# EAGLE design Main-v2.0 (EAGLE 9.1.0)
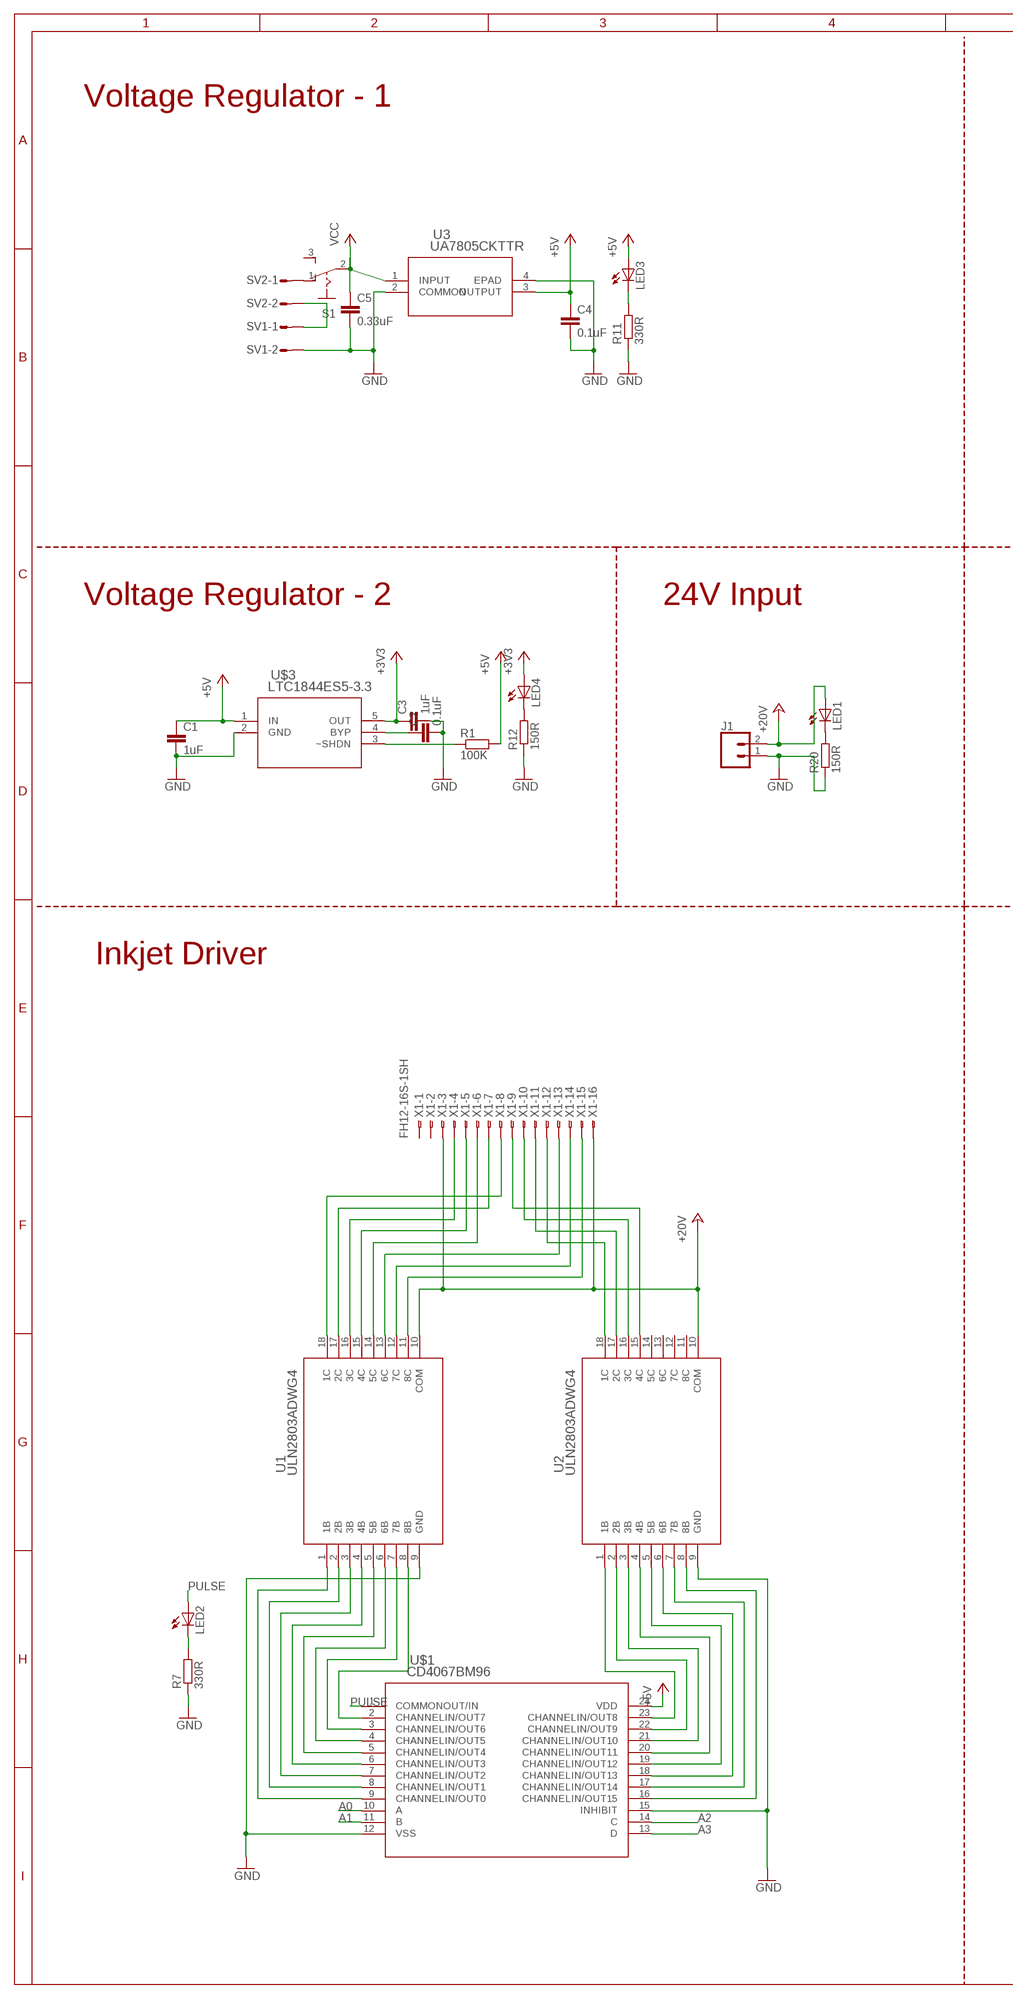
[diagram p0: schematic, sheet 1, part 1 of 2]
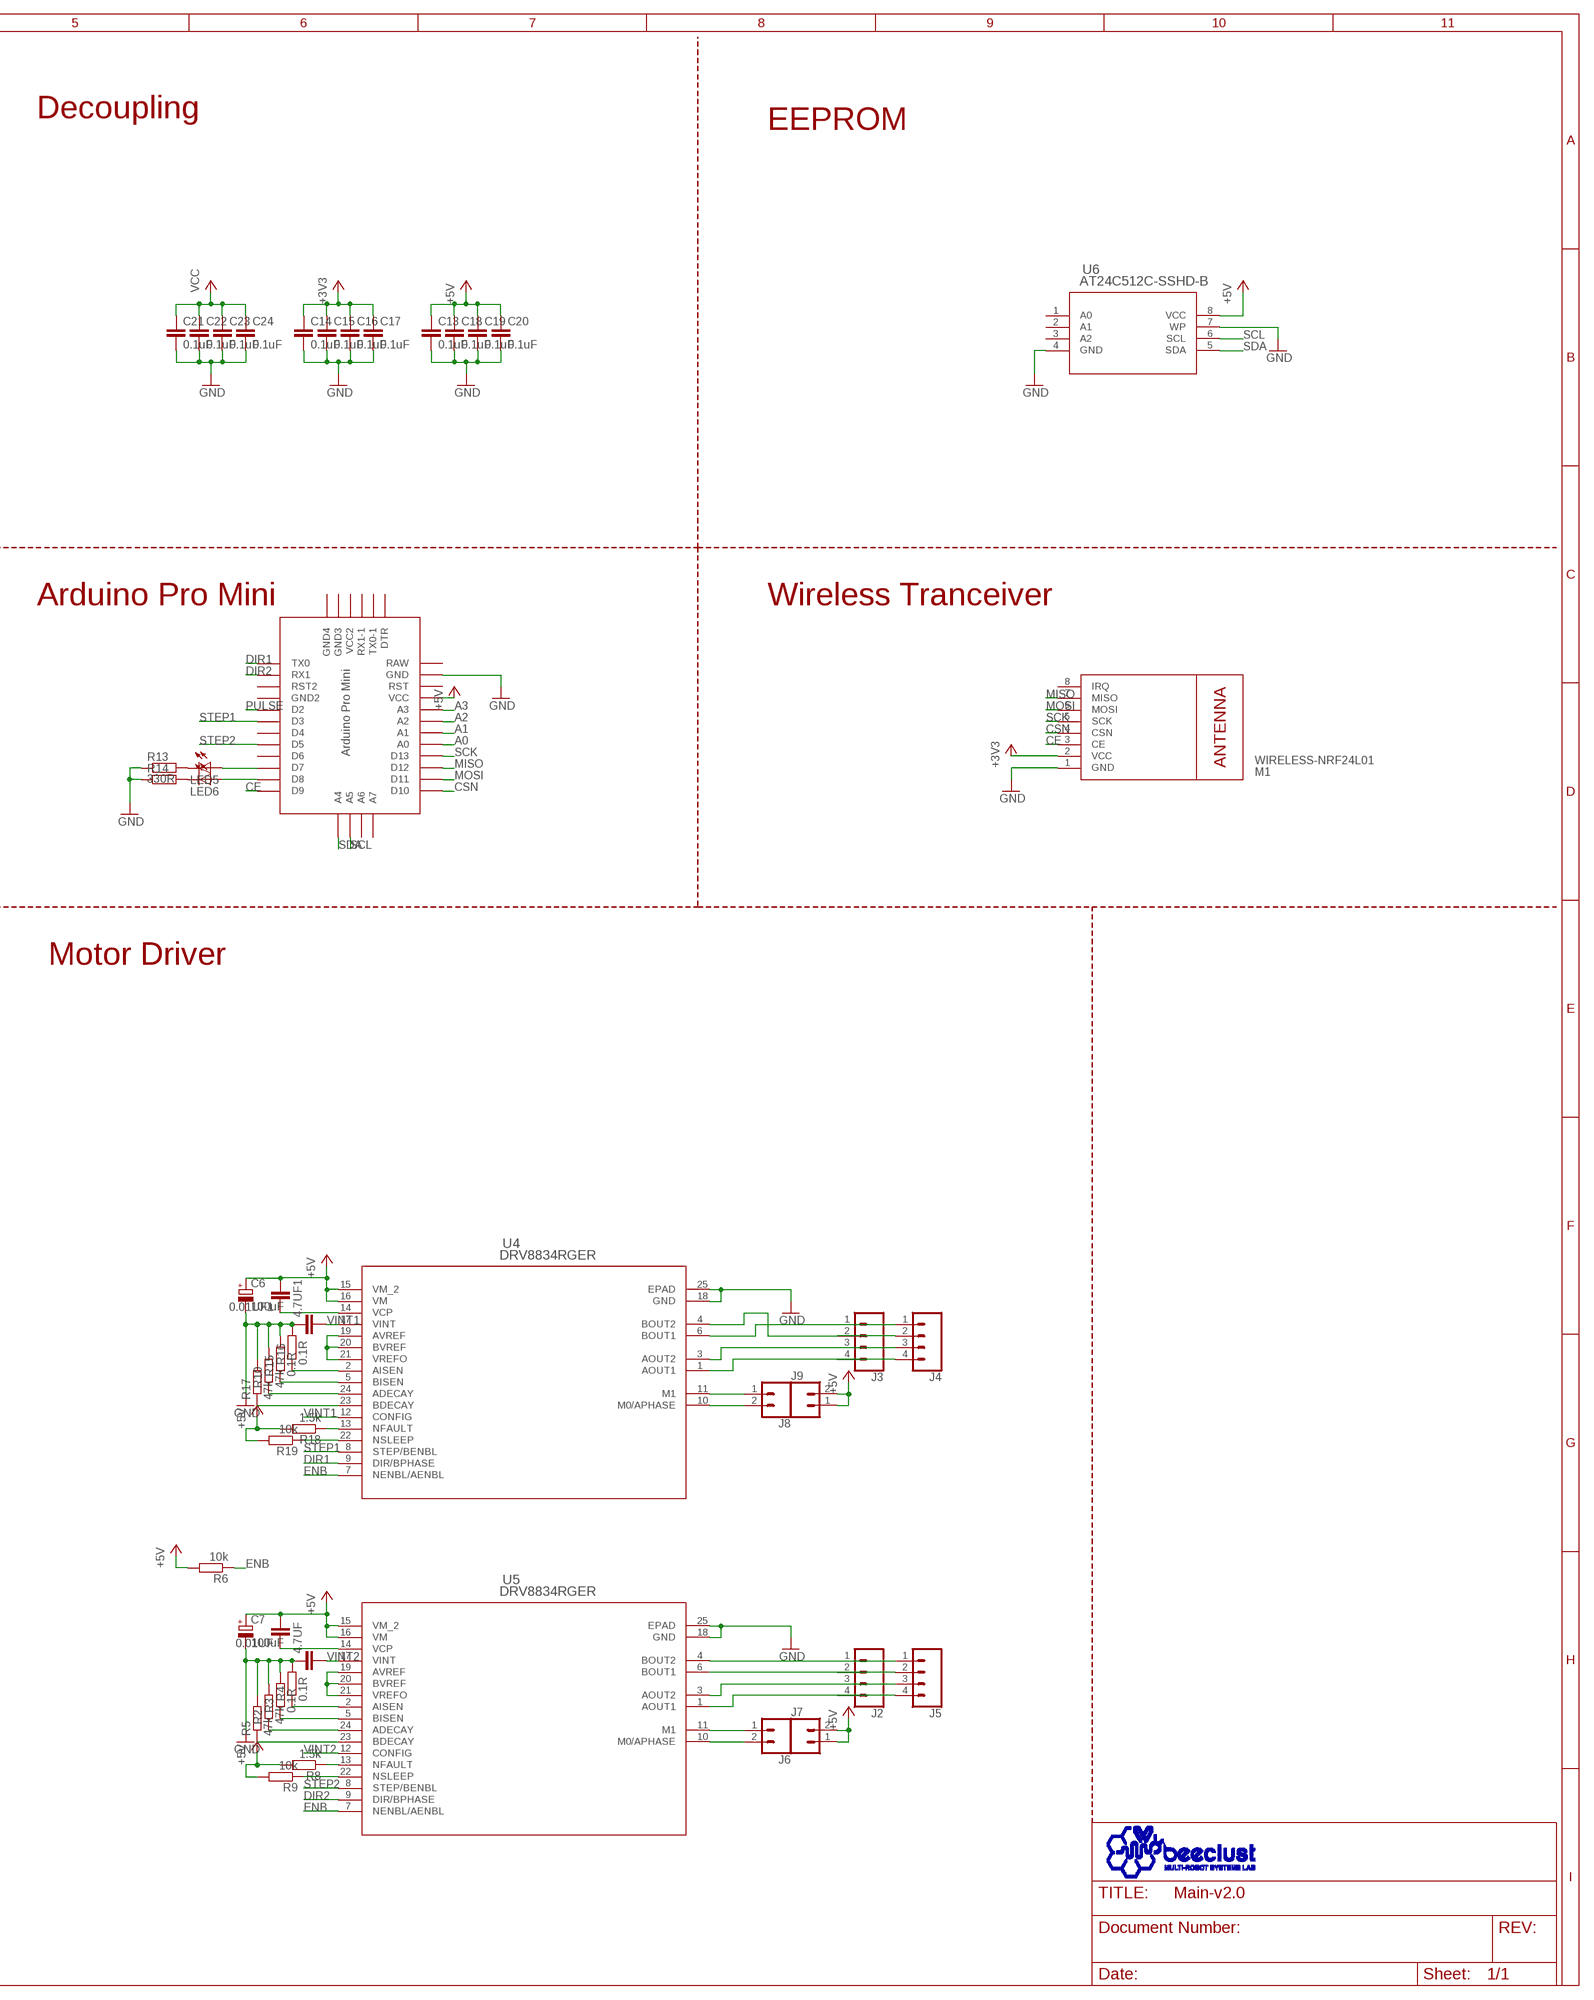
[diagram p1: schematic, sheet 1, part 2 of 2]

## Parts
0.01UF  C-EUC0603K  [C0603K]
0.01UF1  C-EUC0603K  [C0603K]
4.7UF  C-EUC0603K  [C0603K]
4.7UF1  C-EUC0603K  [C0603K]
C1  1uF  C-EUC0603  [C0603]
C2  0.1uF  C-EUC0603  [C0603]
C3  1uF  C-EUC0603  [C0603]
C4  0.1uF  C-EUC0603  [C0603]
C5  0.33uF  C-EUC0603  [C0603]
C6  100uF  CPOL-EUE5-5  [E5-5]
C7  100uF  CPOL-EUE5-5  [E5-5]
C13  0.1uF  C-EUC0603  [C0603]
C14  0.1uF  C-EUC0603  [C0603]
C15  0.1uF  C-EUC0603  [C0603]
C16  0.1uF  C-EUC0603  [C0603]
C17  0.1uF  C-EUC0603  [C0603]
C18  0.1uF  C-EUC0603  [C0603]
C19  0.1uF  C-EUC0603  [C0603]
C20  0.1uF  C-EUC0603  [C0603]
C21  0.1uF  C-EUC0603  [C0603]
C22  0.1uF  C-EUC0603  [C0603]
C23  0.1uF  C-EUC0603  [C0603]
C24  0.1uF  C-EUC0603  [C0603]
J1  CONN_02  [1X02]
J2  CONN_04  [1X04]
J3  CONN_04  [1X04]
J4  CONN_04  [1X04]
J5  CONN_04  [1X04]
J6  CONN_02  [1X02]
J7  CONN_02  [1X02]
J8  CONN_02  [1X02]
J9  CONN_02  [1X02]
LED1  LEDSML0603  [SML0603]
LED2  LEDSML0603  [SML0603]
LED3  LEDSML0603  [SML0603]
LED4  LEDSML0603  [SML0603]
LED5  LEDSML0603  [SML0603]
LED6  LEDSML0603  [SML0603]
M1  WIRELESS-NRF24L01  [WIRELESS-NRF24L01]
R1  100K  R-EU_R0603  [R0603]
R2  47k  R-EU_R0402  [R0402]
R3  0.1R  R-EU_R0402  [R0402]
R4  0.1R  R-EU_R0402  [R0402]
R5  47k  R-EU_R0402  [R0402]
R6  10k  R-EU_R0402  [R0402]
R7  330R  R-EU_R0603  [R0603]
R8  1.5k  R-EU_R0402  [R0402]
R9  10k  R-EU_R0402  [R0402]
R10  47k  R-EU_R0402  [R0402]
R11  330R  R-EU_R0603  [R0603]
R12  150R  R-EU_R0603  [R0603]
R13  330R  R-EU_R0603  [R0603]
R14  R-EU_R0603  [R0603]
R15  0.1R  R-EU_R0402  [R0402]
R16  0.1R  R-EU_R0402  [R0402]
R17  47k  R-EU_R0402  [R0402]
R18  1.5k  R-EU_R0402  [R0402]
R19  10k  R-EU_R0402  [R0402]
R20  150R  R-EU_R0603  [R0603]
S1  255SB  [255SB]
SV1  L02P  [L02P]
SV2  L02P  [L02P]
U1  ULN2803ADWG4  [DW18]
U2  ULN2803ADWG4  [DW18]
U3  UA7805CKTTR  [KTT3_6P22X6P6]
U4  DRV8834RGER  [RGE24_2P45X2P45]
U5  DRV8834RGER  [RGE24_2P45X2P45]
U6  AT24C512C-SSHD-B  [8S1]
U$1  CD4067BM96  [DW24]
U$2  PRO-MINI  [PRO-MINI]
U$3  LTC1844ES5-3.3  [TSOT-23_S5]
U$5  BEECLUST-LOGO  [LOGO]
X1  FH12-16S-1SH  [FH12-16S-1SH]

## Nets
+3V3: C3.1 C14.1 C15.1 C16.1 C17.1 LED4.A M1.2(VCC) U$3.5(OUT)
+5V: 0.01UF1.2 0.01UF.2 C1.1 C4.1 C6.+ C7.+ C13.1 C18.1 C19.1 C20.1 J7.1 J7.2 J9.1 J9.2 LED3.A R1.2 R6.2 R8.2 R9.2 R18.2 R19.2 U3.3(OUTPUT) U4.15(VM_2) U4.16(VM) U5.15(VM_2) U5.16(VM) U6.8(VCC) U$1.24(VDD) U$2.VCC U$3.1(IN)
+24V: J1.2 LED1.A U1.10(COM) U2.10(COM) X1.3 X1.16 ; supply symbol labelled +20V
A0: U$1.10(A) U$2.A0
A1: U$1.11(B) U$2.A1
A2: U$1.14(C) U$2.A2
A3: U$1.13(D) U$2.A3
CE: M1.3(CE) U$2.D9
CSN: M1.4(CSN) U$2.D10
DIR1: U4.9(DIR/BPHASE) U$2.TX0
DIR2: U5.9(DIR/BPHASE) U$2.RX1
ENB: R6.1 U4.7(NENBL/AENBL) U5.7(NENBL/AENBL)
GND: 4.7UF1.1 4.7UF.1 C1.2 C2.2 C3.2 C4.2 C5.2 C6.- C7.- C13.2 C14.2 C15.2 C16.2 C17.2 C18.2 C19.2 C20.2 C21.2 C22.2 C23.2 C24.2 J1.1 M1.1(GND) R2.2 R3.2 R4.2 R5.2 R7.1 R10.2 R11.1 R12.1 R13.1 R14.1 R15.2 R16.2 R17.2 R20.1 SV1.2 U1.9(GND) U2.9(GND) U3.2(COMMON) U3.4(EPAD) U4.18(GND) U4.25(EPAD) U5.18(GND) U5.25(EPAD) U6.4(GND) U6.7(WP) U$1.12(VSS) U$1.15(INHIBIT) U$2.GND U$3.2(GND)
MISO: M1.7(MISO) U$2.D12
MOSI: M1.6(MOSI) U$2.D11
N$1: SV1.1 SV2.2
N$2: U5.19(AVREF) U5.20(BVREF) U5.21(VREFO)
N$3: U1.8(8B) U$1.2(CHANNELIN/OUT7)
N$4: U1.7(7B) U$1.3(CHANNELIN/OUT6)
N$5: U1.6(6B) U$1.4(CHANNELIN/OUT5)
N$6: U1.5(5B) U$1.5(CHANNELIN/OUT4)
N$7: U1.4(4B) U$1.6(CHANNELIN/OUT3)
N$8: U1.3(3B) U$1.7(CHANNELIN/OUT2)
N$9: U1.2(2B) U$1.8(CHANNELIN/OUT1)
N$10: U1.1(1B) U$1.9(CHANNELIN/OUT0)
N$11: U2.1(1B) U$1.23(CHANNELIN/OUT8)
N$12: U2.2(2B) U$1.22(CHANNELIN/OUT9)
N$13: U2.3(3B) U$1.21(CHANNELIN/OUT10)
N$14: U2.4(4B) U$1.20(CHANNELIN/OUT11)
N$15: U2.5(5B) U$1.19(CHANNELIN/OUT12)
N$16: U2.6(6B) U$1.18(CHANNELIN/OUT13)
N$17: J3.1 J4.1 U4.6(BOUT1)
N$18: J3.2 J4.2 U4.4(BOUT2)
N$19: J3.3 J4.3 U4.3(AOUT2)
N$20: J3.4 J4.4 U4.1(AOUT1)
N$21: U1.11(8C) X1.15
N$22: U1.12(7C) X1.14
N$23: U1.13(6C) X1.13
N$24: U1.14(5C) X1.6
N$25: U1.15(4C) X1.5
N$26: U1.16(3C) X1.4
N$27: U1.17(2C) X1.7
N$28: U1.18(1C) X1.8
N$29: U2.8(8B) U$1.16(CHANNELIN/OUT15)
N$30: U2.18(1C) X1.12
N$31: U2.17(2C) X1.11
N$32: U2.16(3C) X1.10
N$33: U2.15(4C) X1.9
N$34: U2.7(7B) U$1.17(CHANNELIN/OUT14)
N$35: J2.1 J5.1 U5.4(BOUT2)
N$36: J2.2 J5.2 U5.6(BOUT1)
N$37: S1.1(O) SV2.1
N$38: C2.1 U$3.4(BYP)
N$39: R1.1 U$3.3(~SHDN)
N$40: J2.3 J5.3 U5.3(AOUT2)
N$41: J2.4 J5.4 U5.1(AOUT1)
N$42: 0.01UF.1 U5.14(VCP)
N$43: R5.1 U5.23(BDECAY)
N$44: R2.1 U5.24(ADECAY)
N$45: LED2.C R7.2
N$46: R3.1 U5.5(BISEN)
N$47: R4.1 U5.2(AISEN)
N$48: R9.1 U5.22(NSLEEP)
N$49: R8.1 U5.13(NFAULT)
N$50: LED3.C R11.2
N$51: LED4.C R12.2
N$52: LED5.C R13.2
N$53: U4.19(AVREF) U4.20(BVREF) U4.21(VREFO)
N$54: R17.1 U4.23(BDECAY)
N$55: LED6.C R14.2
N$56: LED5.A U$2.D7
N$57: LED6.A U$2.D8
N$65: R10.1 U4.24(ADECAY)
N$66: R15.1 U4.5(BISEN)
N$67: R16.1 U4.2(AISEN)
N$68: 0.01UF1.1 U4.14(VCP)
N$73: R19.1 U4.22(NSLEEP)
N$74: R18.1 U4.13(NFAULT)
N$75: J6.2 U5.10(M0/APHASE)
N$76: J6.1 U5.11(M1)
N$77: J8.2 U4.10(M0/APHASE)
N$78: J8.1 U4.11(M1)
N$79: LED1.C R20.2
PULSE: LED2.A U$1.1(COMMONOUT/IN) U$2.D2
SCK: M1.5(SCK) U$2.D13
SCL: U6.6(SCL) U$2.A5
SDA: U6.5(SDA) U$2.A4
STEP1: U4.8(STEP/BENBL) U$2.D3
STEP2: U5.8(STEP/BENBL) U$2.D5
VCC: C5.1 C21.1 C22.1 C23.1 C24.1 S1.2(P) U3.1(INPUT)
VINT1: 4.7UF1.2 U4.12(CONFIG) U4.17(VINT)
VINT2: 4.7UF.2 U5.12(CONFIG) U5.17(VINT)
Unconnected: M1.8(IRQ) S1.3(S) U2.11(8C) U2.12(7C) U2.13(6C) U2.14(5C) U6.1(A0) U6.2(A1) U6.3(A2) U$2.A6 U$2.A7 U$2.D4 U$2.D6 U$2.DTR U$2.GND1(GND2) U$2.GND2(GND4) U$2.GND3 U$2.RST U$2.RST1(RST2) U$2.RX1-1 U$2.TX0-1 U$2.VCC1(VCC2) X1.1 X1.2

## Notes on the sheet
- Voltage Regulator - 1
- Decoupling
- EEPROM
- Voltage Regulator - 2 | 24V Input | Arduino Pro Mini | Wireless Tranceiver
- Inkjet Driver | Motor Driver

## Power pins joined to a net without a drawn wire
RAW: U$2.RAW

## Library data of the parts
0.01UF 0.01UF1 4.7UF 4.7UF1 C1-C5 C13-C24 = resistor:C-EU: CAPACITOR, European symbol
C6 C7 = resistor:CPOL-EU: POLARIZED CAPACITOR, European symbol
J1 J6-J9 = SparkFun-Connectors:CONN_02: Multi connection point. Often used as Generic Header-pin footprint for 0.1 inch spaced/style header connections On any of the 0.1 inch spaced packages, you can populate with these: Break Away Headers - Straight (PRT-00116) Break Away Male Headers - Right Angle (PRT-00553) Female Headers (PRT-00115) Break Away Headers - Machine Pin (PRT-00117) Break Away Female Headers - Swiss Machine Pin (PRT-00743) For SCREWTERMINALS and SPRING TERMINALS visit here: Screw Terimnals on SparkFun.com (5mm/3.5mm/2.54mm spacing) This device is also useful as a general connection point to wire up your design to another part of your project. Our various solder wires solder well into these plated through hole pads. Hook-Up Wire - Assortment (Stranded, 22 AWG) (PRT-11375) Hook-Up Wire - Assortment (Solid Core, 22 AWG) (PRT-11367) View the entire wire category on our website here Special notes: Molex polarized connector foot print use with: PRT-08233 with associated crimp pins and housings. 2.54_SCREWTERM for use with PRT-10571. 3.5mm Screw Terminal footprints for PRT-08084 5mm Screw Terminal footprints for use with PRT-08432
J2-J5 = SparkFun-Connectors:CONN_04: Multi connection point. Often used as Generic Header-pin footprint for 0.1 inch spaced/style header connections On any of the 0.1 inch spaced packages, you can populate with these: Break Away Headers - Straight (PRT-00116) Break Away Male Headers - Right Angle (PRT-00553) Female Headers (PRT-00115) Break Away Headers - Machine Pin (PRT-00117) Break Away Female Headers - Swiss Machine Pin (PRT-00743) For SCREWTERMINALS and SPRING TERMINALS visit here: Screw Terimnals on SparkFun.com (5mm/3.5mm/2.54mm spacing) This device is also useful as a general connection point to wire up your design to another part of your project. Our various solder wires solder well into these plated through hole pads. Hook-Up Wire - Assortment (Stranded, 22 AWG) (PRT-11375) Hook-Up Wire - Assortment (Solid Core, 22 AWG) (PRT-11367) View the entire wire category on our website here Special notes: Molex polarized connector foot print use with SKU : PRT-08231 with associated crimp pins and housings. 1MM SMD Version SKU: PRT-10208; PROD_ID: CONN-09696
LED1-LED6 = led:LED: LED OSRAM: - CHIPLED LG R971, LG N971, LY N971, LG Q971, LY Q971, LO R971, LY R971 LH N974, LH R974 LS Q976, LO Q976, LY Q976 LO Q996 - Hyper CHIPLED LW Q18S LB Q993, LB Q99A, LB R99A - SideLED LS A670, LO A670, LY A670, LG A670, LP A670 LB A673, LV A673, LT A673, LW A673 LH A674 LY A675 LS A676, LA A676, LO A676, LY A676, LW A676 LS A679, LY A679, LG A679 - Hyper Micro SIDELED® LS Y876, LA Y876, LO Y876, LY Y876 LT Y87S - SmartLED LW L88C, LW L88S LB L89C, LB L89S, LG L890 LS L89K, LO L89K, LY L89K LS L896, LA L896, LO L896, LY L896 - TOPLED LS T670, LO T670, LY T670, LG T670, LP T670 LSG T670, LSP T670, LSY T670, LOP T670, LYG T670 LG T671, LOG T671, LSG T671 LB T673, LV T673, LT T673, LW T673 LH T674 LS T676, LA T676, LO T676, LY T676, LB T676, LH T676, LSB T676, LW T676 LB T67C, LV T67C, LT T67C, LS T67K, LO T67K, LY T67K, LW E67C LS E67B, LA E67B, LO E67B, LY E67B, LB E67C, LV E67C, LT E67C LW T67C LS T679, LY T679, LG T679 LS T770, LO T770, LY T770, LG T770, LP T770 LB T773, LV T773, LT T773, LW T773 LH T774 LS E675, LA E675, LY E675, LS T675 LS T776, LA T776, LO T776, LY T776, LB T776 LHGB T686 LT T68C, LB T68C - Hyper Mini TOPLED® LB M676 - Mini TOPLED Santana® LG M470 LS M47K, LO M47K, LY M47K Source: http://www.osram.convergy.de LUXEON: - LUMILED® LXK2-PW12-R00, LXK2-PW12-S00, LXK2-PW14-U00, LXK2-PW14-V00 LXK2-PM12-R00, LXK2-PM12-S00, LXK2-PM14-U00 LXK2-PE12-Q00, LXK2-PE12-R00, LXK2-PE12-S00, LXK2-PE14-T00, LXK2-PE14-U00 LXK2-PB12-K00, LXK2-PB12-L00, LXK2-PB12-M00, LXK2-PB14-N00, LXK2-PB14-P00, LXK2-PB14-Q00 LXK2-PR12-L00, LXK2-PR12-M00, LXK2-PR14-Q00, LXK2-PR14-R00 LXK2-PD12-Q00, LXK2-PD12-R00, LXK2-PD12-S00 LXK2-PH12-R00, LXK2-PH12-S00 LXK2-PL12-P00, LXK2-PL12-Q00, LXK2-PL12-R00 Source: www.luxeon.com KINGBRIGHT: KA-3528ASYC Source: www.kingbright.com
M1 = diy-modules:WIRELESS-NRF24L01: 2.4 GHz Wireless Module based on NRF24L01 chip More details available here: http://www.electrodragon.com/w/NRF24L01 Click here to find device on ebay.com
R1-R20 = resistor:R-EU_: RESISTOR, European symbol
S1 = switch:255SB: SLIDING SWITCH Distributor Buerklin, 11G810
SV1 SV2 = con-amp-mt:L02P: AMP MT CONNECTOR; OC_FARNELL: unknown; OC_NEWARK: unknown
U1 U2 = Beeclust:ULN2803ADWG4; MANUFACTURER_PART_NUMBER: ULN2803ADWG4; VENDOR: Texas Instruments
U3 = Beeclust:UA7805CKTTR; MANUFACTURER_PART_NUMBER: UA7805CKTTR; VENDOR: Texas Instruments
U4 U5 = Beeclust:DRV8834RGER; MANUFACTURER_PART_NUMBER: DRV8834RGER; VENDOR: Texas Instruments
U6 = Beeclust:AT24C512C-SSHD-B; MANUFACTURER_PART_NUMBER: AT24C512CSSHDB; VENDOR: ATMEL
U$1 = Beeclust:CD4067BM96; MANUFACTURER_PART_NUMBER: CD4067B_DW_24; VENDOR: Texas Instruments
U$2 = Arduino-clone:PRO-MINI: Arduion Pro Mini Clone V1.0 www.betemcu.cu
U$3 = Beeclust:LTC1844ES5-3.3
U$5 = Beeclust:BEECLUST-LOGO
X1 = con-hirose:FH12-16S-1S: 1mm Pitch Connectors For FPC/FFC Source: Data sheet; OC_FARNELL: unknown; OC_NEWARK: unknown

## Board
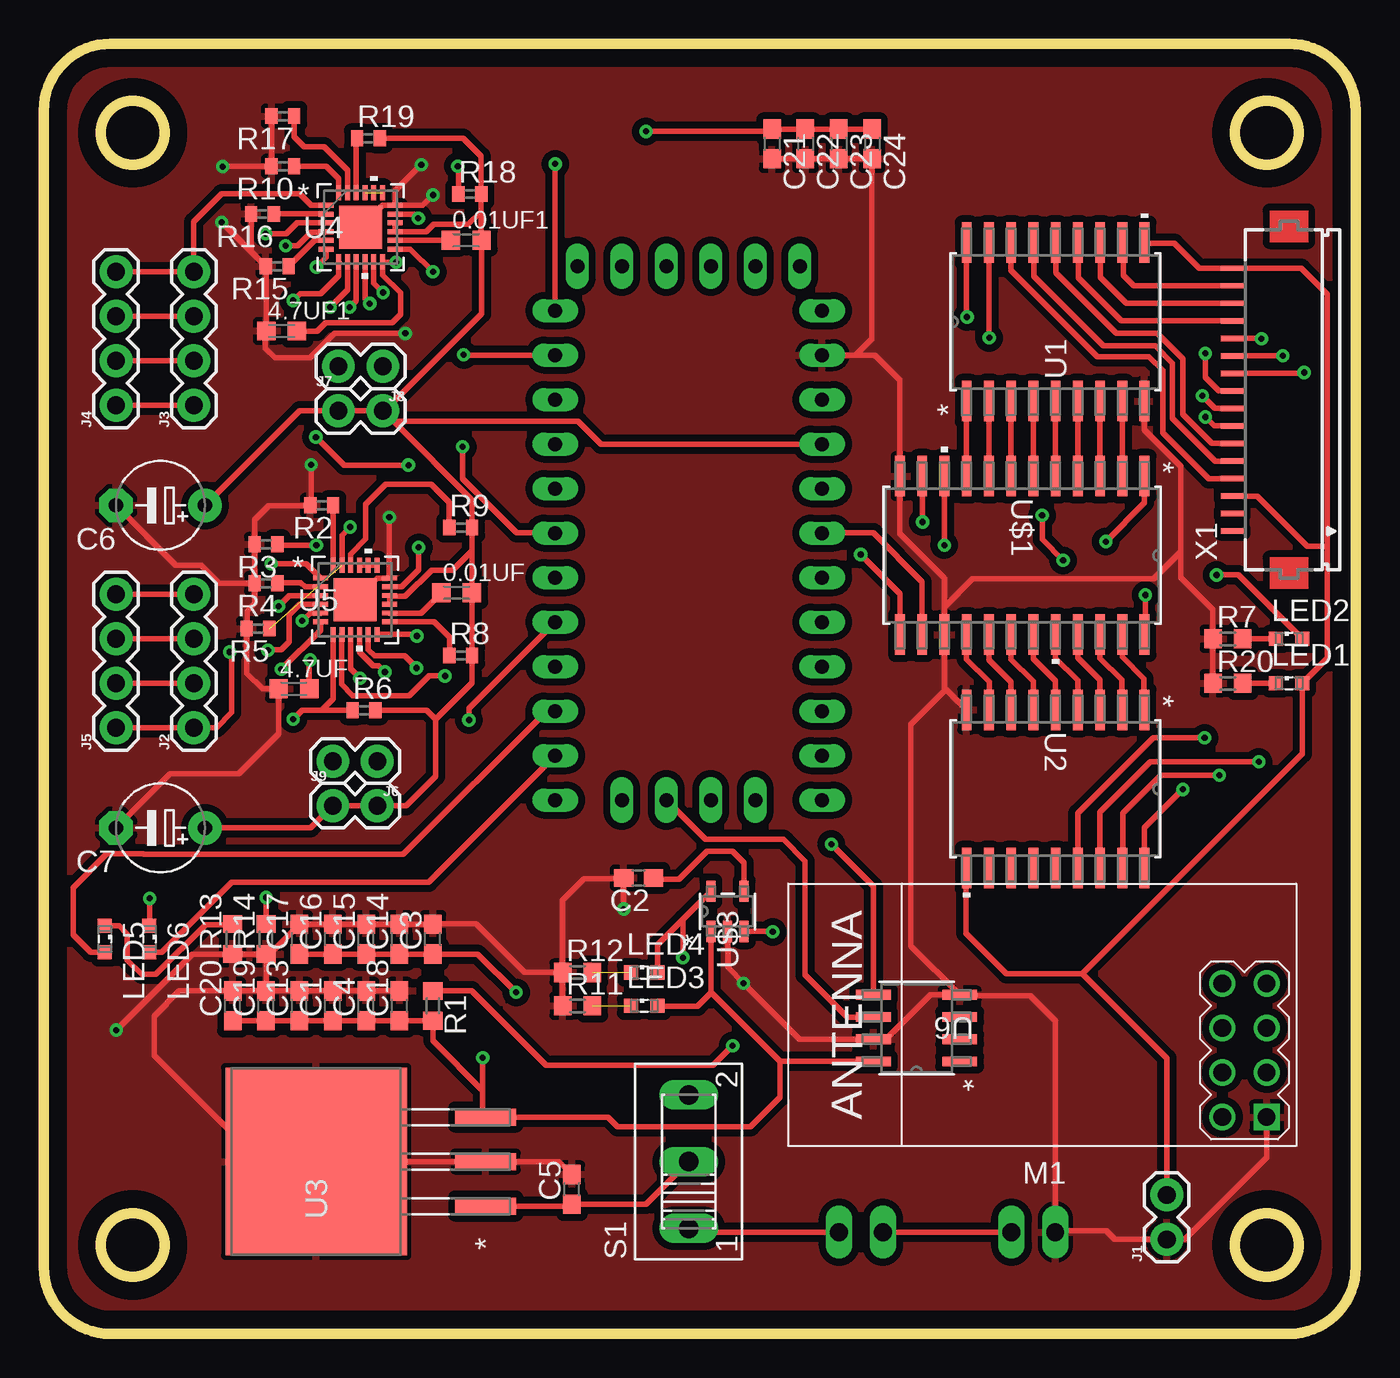
[diagram p2: board, top side]
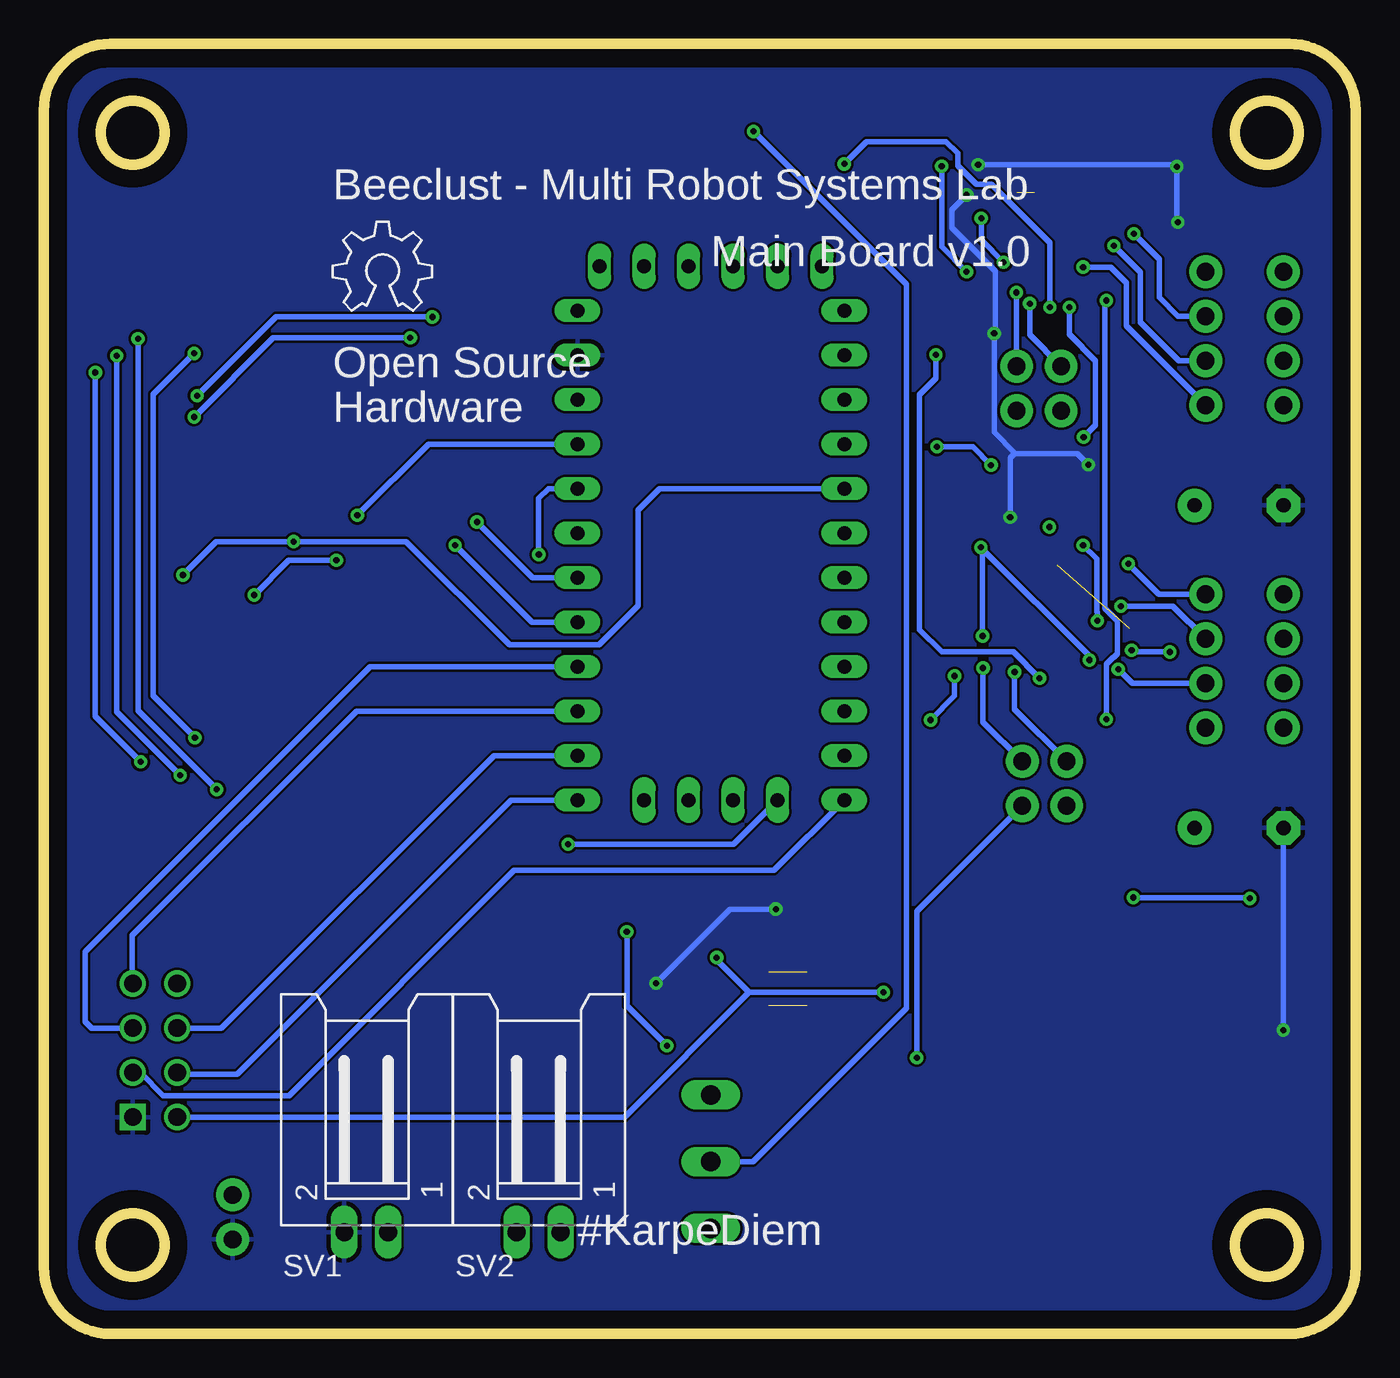
[diagram p3: board, bottom side, seen from below]

Size 74.93 x 73.66 mm. Coordinates in mm from the lower left corner, seen from the top.
Outline: 0,3.81 arc90 3.81,0 71.12,0 arc90 74.93,3.81 74.93,69.85 arc90 71.12,73.66 3.81,73.66 arc90 0,69.85 0,3.81
Outline: circle at 69.85,68.58 radius 1.8
Outline: circle at 5.08,68.58 radius 1.8
Outline: circle at 5.08,5.08 radius 1.8
Outline: circle at 69.85,5.08 radius 1.8
Copper layers (1*16): Top 0.035mm / dielectric 1.5mm / Bottom 0.035mm
Design rules "default": minimum track width 6mil, minimum drill 0.35mm, track to track 6mil, track to pad 6mil, pad to pad 6mil, via to via 6mil, smd to smd 6mil, copper to edge 40mil, drill to drill 6mil, minimum pad ring 10mil, minimum via ring 8mil, stop-mask expansion 4mil, vias tented up to drill 0mil, thermal gap 10mil

### Footprints (pad centres in the part's own frame; a part is rotated, then mirrored left to right if it is on the bottom)
C0603K = smd 1.05 x 1.08: 1 -0.875,0; 2 0.875,0
C0603 = smd 1.1 x 1: 1 -0.85,0; 2 0.85,0
E5-5 = drill 0.813 pad 1.905: + -2.54,0 | drill 0.813 pad 1.905 octagon: - 2.54,0
1X02 = drill 1.016 pad 1.88: 1 0,0; 2 2.54,0
1X04 = drill 1.016 pad 1.88: 1 0,0; 2 2.54,0; 3 5.08,0; 4 7.62,0
SML0603 = smd 0.8 x 0.8: A 0.75,0; C -0.75,0
WIRELESS-NRF24L01 = drill 1 square: 1 -12.7,6.35 | drill 1: 2 -10.16,6.35; 3 -12.7,3.81; 4 -10.16,3.81; 5 -12.7,1.27; 6 -10.16,1.27; 7 -12.7,-1.27; 8 -10.16,-1.27
R0603 = smd 1 x 1.1: 1 -0.85,0; 2 0.85,0
R0402 = smd 0.7 x 0.9: 1 -0.65,0; 2 0.65,0
255SB = drill 1.118 long: 1 -3.81,0; 2 0,0; 3 3.81,0
L02P = drill 1.016 long: 1 1.25,-6.25; 2 -1.25,-6.25
DW18 = smd 2.311 x 0.559: 1 -4.521,5.08; 2 -4.521,3.81; 3 -4.521,2.54; 4 -4.521,1.27; 5 -4.521,0; 6 -4.521,-1.27; 7 -4.521,-2.54; 8 -4.521,-3.81; 9 -4.521,-5.08; 10 4.521,-5.08; 11 4.521,-3.81; 12 4.521,-2.54; 13 4.521,-1.27; 14 4.521,0; 15 4.521,1.27; 16 4.521,2.54; 17 4.521,3.81; 18 4.521,5.08
KTT3_6P22X6P6 = smd 0.965 x 3.505: 1 -2.54,-9.677; 2 0,-9.677; 3 2.54,-9.677 | smd 10.719 x 10.363: 4 0,0
RGE24_2P45X2P45 = smd 0.85 x 0.28: 1 -1.975,1.25; 2 -1.975,0.75; 3 -1.975,0.25; 4 -1.975,-0.25; 5 -1.975,-0.75; 6 -1.975,-1.25; 13 1.975,-1.25; 14 1.975,-0.75; 15 1.975,-0.25; 16 1.975,0.25; 17 1.975,0.75; 18 1.975,1.25 | smd 0.28 x 0.85: 7 -1.25,-1.975; 8 -0.75,-1.975; 9 -0.25,-1.975; 10 0.25,-1.975; 11 0.75,-1.975; 12 1.25,-1.975; 19 1.25,1.975; 20 0.75,1.975; 21 0.25,1.975; 22 -0.25,1.975; 23 -0.75,1.975; 24 -1.25,1.975 | smd 2.45 x 2.45: 25 0,0
8S1 = smd 1.981 x 0.561: 1 -2.465,1.905; 2 -2.465,0.635; 3 -2.465,-0.635; 4 -2.465,-1.905; 5 2.465,-1.905; 6 2.465,-0.635; 7 2.465,0.635; 8 2.465,1.905
DW24 = smd 2.311 x 0.559: 1 -4.521,6.985; 2 -4.521,5.715; 3 -4.521,4.445; 4 -4.521,3.175; 5 -4.521,1.905; 6 -4.521,0.635; 7 -4.521,-0.635; 8 -4.521,-1.905; 9 -4.521,-3.175; 10 -4.521,-4.445; 11 -4.521,-5.715; 12 -4.521,-6.985; 13 4.521,-6.985; 14 4.521,-5.715; 15 4.521,-4.445; 16 4.521,-3.175; 17 4.521,-1.905; 18 4.521,-0.635; 19 4.521,0.635; 20 4.521,1.905; 21 4.521,3.175; 22 4.521,4.445; 23 4.521,5.715; 24 4.521,6.985
PRO-MINI = drill 0.8 long: A0 8.89,8.89; A1 8.89,11.43; A2 8.89,13.97; A3 8.89,16.51; A4 -2.54,-1.27; A5 0,-1.27; A6 2.54,-1.27; A7 5.08,-1.27; D2 -6.35,16.51; D3 -6.35,13.97; D4 -6.35,11.43; D5 -6.35,8.89; D6 -6.35,6.35; D7 -6.35,3.81; D8 -6.35,1.27; D9 -6.35,-1.27; D10 8.89,-1.27; D11 8.89,1.27; D12 8.89,3.81; D13 8.89,6.35; DTR 7.62,29.21; GND 8.89,24.13; GND1 -6.35,19.05; GND2 -5.08,29.21; GND3 -2.54,29.21; RAW 8.89,26.67; RST 8.89,21.59; RST1 -6.35,21.59; RX1 -6.35,24.13; RX1-1 2.54,29.21; TX0 -6.35,26.67; TX0-1 5.08,29.21; VCC 8.89,19.05; VCC1 0,29.21
TSOT-23_S5 = smd 1.219 x 0.508: 1 -1.143,0.95; 2 -1.143,0; 3 -1.143,-0.95; 4 1.143,-0.95; 5 1.143,0.95
FH12-16S-1SH = smd 0.3 x 1.3: 1 -7.5,3.25; 2 -6.5,3.25; 3 -5.5,3.25; 4 -4.5,3.25; 5 -3.5,3.25; 6 -2.5,3.25; 7 -1.5,3.25; 8 -0.5,3.25; 9 0.5,3.25; 10 1.5,3.25; 11 2.5,3.25; 12 3.5,3.25; 13 4.5,3.25; 14 5.5,3.25; 15 6.5,3.25; 16 7.5,3.25

### Placement (x,y rotation side)
0.01UF  23.58,42.32 0 top
0.01UF1  24.13,62.45 0 top
4.7UF  14.29,36.83 0 top
4.7UF1  13.59,57.26 0 top
C1  16.51,18.73 90 top
C2  33.97,26.04 180 top
C3  22.23,22.54 90 top
C4  18.41,18.73 90 top
C5  30.16,8.26 90 top
C6  6.67,47.31 180 top
C7  6.67,28.89 180 top
C13  14.61,18.73 90 top
C14  20.32,22.54 90 top
C15  18.41,22.54 90 top
C16  16.51,22.54 90 top
C17  14.61,22.54 90 top
C18  20.32,18.73 90 top
C19  12.7,18.73 90 top
C20  10.79,18.73 90 top
C21  41.59,67.95 270 top
C22  43.5,67.95 270 top
C23  45.4,67.95 270 top
C24  47.31,67.95 270 top
J1  64.14,5.4 90 top
J2  8.57,34.61 90 top
J3  8.57,53.02 90 top
J4  4.13,53.02 90 top
J5  4.13,34.61 90 top
J6  19.05,32.7 180 top
J7  16.83,52.7 0 top
J8  19.37,55.24 180 top
J9  16.51,30.16 0 top
LED1  71.12,37.15 0 top
LED2  71.12,39.69 0 top
LED3  34.29,18.73 0 top
LED4  34.29,20.64 0 top
LED5  3.49,22.54 270 top
LED6  6.03,22.54 270 top
M1  57.15,18.73 180 top
R1  22.23,18.73 270 top
R2  15.88,47.31 180 top
R3  12.7,45.08 180 top
R4  12.7,42.86 180 top
R5  12.24,40.27 180 top
R6  18.29,35.61 0 top
R7  67.63,39.69 0 top
R8  23.81,38.73 0 top
R9  23.81,46.04 0 top
R10  13.65,66.67 180 top
R11  30.48,18.73 0 top
R12  30.48,20.64 0 top
R13  10.79,22.54 90 top
R14  12.7,22.54 90 top
R15  13.34,60.96 180 top
R16  12.5,63.94 180 top
R17  13.65,69.53 180 top
R18  24.33,65.09 0 top
R19  18.54,68.26 0 top
R20  67.63,37.15 0 top
S1  36.83,9.84 90 top
SV1  56.52,12.07 0 bottom
SV2  46.67,12.07 0 bottom
U1  57.78,57.78 90 top
U2  57.78,31.11 270 top
U3  15.56,9.84 90 top
U4  18.1,63.18 0 top
U5  17.78,41.91 0 top
U6  49.85,17.46 180 top
U$1  55.88,44.45 270 top
U$2  35.56,31.75 0 top
U$3  39.05,24.13 90 top
U$4  [OSHW_6X200_NOTEXT]  58.42,58.42 0 bottom
U$5  -4.88,-14.05 0 top  (outside the outline)
X1  71.12,53.34 90 top

### Tracks (layer width: path | path; a pad name or v marks a point on that pad's centre or on a via)
+3V3  (via drill 0.35)
  Top 0.305: LED4.A 35.04,22.21 36.5,23.67 | U$3.5 36.53,23.7 36.5,23.67 | C17.1 C16.1 C15.1 C14.1 C3.1 24.79,21.69 v26.98,19.51 | v36.5,21.49 36.5,23.67
  Bottom 0.305: v36.5,21.49 36.56,21.43 34.65,19.51 | 34.65,19.51 v26.98,19.51 | 34.65,19.51 41.77,12.38 M1.2
+5V  (via drill 0.35)
  Top 0.305: 24.98,64.08 24.98,62.47 0.01UF1.2 25,58.25 19.41,52.66 | 24.98,64.08 R18.2 24.97,65.1 24.97,67.23 23.94,68.26 R19.2 | U4.16 U4.15 21.84,62.93 22.25,63.35 24.25,63.35 24.98,64.08 | C7.+ 15.24,28.89 J9.1 J9.2 20.69,30.16 22.38,31.85 22.38,35.1 | 38.1,19.51 U$3.1 | 38.1,19.51 38.1,19.48 37.34,18.72 35.05,18.72 LED3.A | U6.8 42.05,15.56 | 42.05,15.56 38.1,19.51 | 25.07,13.89 22.23,16.74 R1.2 C18.1 C4.1 C1.1 C13.1 C19.1 C20.1 | 25.07,13.89 25.07,12.55 U3.3 32.22,12.38 32.77,11.84 40.36,11.84 42.05,13.53 42.05,15.56 | C6.+ 14.61,52.7 J7.1 J7.2 19.41,52.66 | 20,52.08 19.41,52.66 | 20,52.08 24.46,47.61 R9.2 24.46,44.73 | 24.46,42.34 24.46,44.73 | 24.46,42.34 0.01UF.2 | 24.46,44.73 23.34,43.61 22.15,43.61 20.65,42.11 19.8,42.11 U5.16 U5.15 | 24.46,42.34 R8.2 24.46,37.19 22.38,35.1 | v57.02,46.74 57.02,45.36 v58.22,44.17 | v62.92,42.19 62.92,39.98 U$1.24 | 25.07,13.89 v25.07,15.77 | U$2.VCC 31.83,50.8 30.5,52.12 20.04,52.12 20,52.08 | 22.38,35.1 21.87,35.61 R6.2
  Bottom 0.305: U$2.VCC 52.96,50.8 v57.02,46.74 | v58.22,44.17 60.94,44.17 v62.92,42.19 | v25.07,15.77 25.07,24.14 J9.2
+24V
  Top 0.305: U2.10 52.68,26.57 52.68,22.89 54.99,20.57 59.31,20.57 | 59.31,20.57 64.14,15.75 J1.2 | 59.31,20.57 71.87,33.13 LED1.A 73.3,38.58 73.3,44.98 | U1.10 62.89,62.28 64.57,62.28 66.01,60.84 X1.16 71.82,60.84 73.3,59.36 73.3,44.98 | 73.3,44.98 72.16,44.98 69.32,47.83 67.88,47.83 X1.3
A0  (via drill 0.35)
  Top 0.305: v51.44,45.03 U$1.10
  Bottom 0.305: U$2.A0 47.04,40.64 v51.44,45.03
A1  (via drill 0.35)
  Top 0.305: v50.19,46.35 50.19,48.95 U$1.11
  Bottom 0.305: U$2.A1 47.02,43.18 v50.19,46.35
A2
  Top 0.305: U$1.14 50.16,42.95 47.37,45.74 44.48,45.74 U$2.A2
A3  (via drill 0.35)
  Top 0.305: U$1.13 48.9,42.27 v46.66,44.5
  Bottom 0.305: v46.66,44.5 46.66,47.7 46.1,48.26 U$2.A3
CE
  Bottom 0.305: M1.3 69.41,14.92 68.1,13.61 60.91,13.61 48.06,26.47 33.22,26.47 U$2.D9
CSN
  Bottom 0.305: U$2.D10 48.23,30.48 63.88,14.83 67.22,14.83 M1.4
DIR1  (via drill 0.35)
  Top 0.305: U4.9 17.85,58.99 v17.48,58.62 | v29.21,66.8 U$2.TX0
  Bottom 0.305: v17.48,58.62 17.48,62.31 20.8,65.63 21.67,65.63 22.73,66.7 22.73,67.41 23.39,68.07 27.94,68.07 v29.21,66.8
DIR2  (via drill 0.35)
  Top 0.305: U5.9 17.53,37.97 v18.06,37.44 | v23.98,55.9 24,55.88 U$2.RX1
  Bottom 0.305: 18.06,37.54 v18.06,37.44 19.56,38.94 23.65,38.94 24.92,40.21 24.92,53.62 23.98,54.56 v23.98,55.9
ENB  (via drill 0.35)
  Top 0.305: U5.7 16.53,36.26 15.88,35.61 | 16.87,61.19 U4.7 16.85,60.41 15.82,59.38 14.63,59.38 v14.25,59 | 15.88,35.61 R6.1 | 15.88,35.61 14.76,35.61 v14.25,35.1
  Bottom 0.305: v14.25,35.1 14.25,38.23 13.85,38.63 13.82,38.63 13.61,38.84 13.61,40.72 14.33,41.43 14.33,58.93 v14.25,59
GND  (via drill 0.35)
  Top 0.305: M1.1 69.85,10.08 65.16,5.4 J1.1 61.18,5.4 60.68,5.89 57.84,5.89 SV1.2 57.77,17.88 56.34,19.3 52.38,19.3 U6.4 | R11.1 R12.1 | C5.2 29.43,9.84 U3.2 U3.4 12.38,9.84 6.3,15.93 6.3,18.14 7.75,19.58 C20.2 C19.2 | U6.4 50.65,19.38 48.09,16.83 U6.7 43.17,16.83 v39.97,20.03 39.06,20.93 39.06,22.97 U$3.2 | R12.1 27.47,20.64 24.69,23.42 22.25,23.42 C3.2 C14.2 C15.2 C16.2 C17.2 12.9,21.69 R14.1 | C7.- 7.21,31.98 11.12,31.98 13.41,34.27 4.7UF.1 | 4.7UF.1 13.35,36.89 | U5.25 19.02,43.15 19.3,43.15 19.3,43.16 U5.18 19.74,43.18 v19.74,46.63 | U6.4 49.53,22.15 49.53,34.82 51.44,36.73 51.44,36.78 | 51.44,36.78 U$1.15 51.44,41.5 | U2.9 51.56,36.78 51.44,36.78 | 51.44,41.5 51.44,43.15 48.9,45.7 U$1.12 48.9,54.46 47.47,55.88 46.35,55.88 | 46.35,55.88 U$2.GND | U1.9 62.87,51.61 64.95,49.53 64.95,44.65 | 64.95,44.65 64.95,43.18 66.78,41.35 R7.1 | 66.57,39.89 R7.1 | R14.1 R13.1 8.48,21.69 v4.14,17.35 | C19.2 R14.1 | C19.2 C13.2 C1.2 C4.2 C18.2 | C21.2 C22.2 C23.2 C24.2 47.31,56.83 46.35,55.88 | R7.1 R20.1 | 51.44,41.5 53.03,43.1 63.4,43.1 64.95,44.65 | 12.7,60.95 R15.2 | R17.2 R10.2 10.24,66.67 v10.21,66.65 | R12.1 29.63,24.75 30.86,25.98 33.07,25.98 C2.2 v33.12,24.26 | R4.2 R3.2 12.05,46.49 12.85,47.29 15.21,47.29 R2.2 15.27,47.35 v15.27,49.63 | 4.7UF.1 12.5,36.83 11.59,37.73 R5.2 11.61,40.29 11.61,41.27 12.05,41.72 R4.2 | R15.2 11.85,61.8 | 11.85,61.8 R16.2 | 11.85,61.8 v10.17,63.48 v10.16,63.48 | U4.18 20.07,65.26 v21.57,66.75 | R4.2 10.02,42.86 8.99,43.89 7.54,43.89 C6.- | R15.2 12.71,60.93 4.7UF1.1 12.65,57.2 12.65,56.29 13.21,55.73 15.21,55.73 16.61,57.12 v20.65,57.12 | U4.18 21.63,64.43 v22.23,65.02
  Top 0.305: U4.18 19.62,64.43 19.61,64.43 19.34,64.43 U4.25
  Bottom 0.305: v4.14,17.35 C7.- | v33.12,24.26 35.74,24.26 v39.97,20.03 | v10.16,63.48 10.21,63.52 v10.21,66.65 10.31,66.75 v21.57,66.75 | 19.46,50.29 20.65,51.49 v20.65,57.12 20.57,57.2 20.57,60.68 23.06,63.17 23.06,64.19 v22.23,65.02 | 19.46,50.29 19.43,50.27 15.9,50.27 v15.27,49.63 | v19.74,46.63 19.74,50.01 19.46,50.29
  pour Top (isolate 0.406): 0.64,73.03 74.3,73.03 74.3,59.05 74.3,1.27 0.64,1.27
  pour Bottom: 1.27,73.03 74.04,73.03 arc-90 74.3,72.14 74.3,1.27 0.89,1.27 arc-90 0.64,1.52 0.64,72.39
MISO
  Bottom 0.305: U$2.D12 57.07,35.56 69.88,22.76 69.88,20.03 M1.7
MOSI
  Bottom 0.305: U$2.D11 49.23,33.02 64.8,17.45 67.3,17.45 M1.6
N$1
  Top 0.305: SV1.1 SV2.2
N$2
  Top 0.305: U5.19 U5.20 U5.21
N$3
  Top 0.305: U1.8 U$1.2
N$4
  Top 0.305: U1.7 U$1.3
N$5
  Top 0.305: U1.6 U$1.4
N$6
  Top 0.305: U1.5 U$1.5
N$7
  Top 0.305: U1.4 U$1.6
N$8
  Top 0.305: U1.3 U$1.7
N$9
  Top 0.305: U1.2 U$1.8
N$10
  Top 0.305: U1.1 U$1.9
N$11
  Top 0.305: U$1.23 61.59,38.66 62.84,37.41 62.84,35.66 U2.1
N$12
  Top 0.305: U$1.22 60.33,38.58 61.57,37.34 61.57,35.66 U2.2
N$13
  Top 0.305: U$1.21 59.05,38.61 60.33,37.34 U2.3
N$14
  Top 0.305: U$1.20 57.78,38.58 59.05,37.31 U2.4
N$15
  Top 0.305: U$1.19 56.52,38.56 57.78,37.29 U2.5
N$16
  Top 0.305: U$1.18 55.24,38.53 56.52,37.26 U2.6
N$17  (via drill 0.35)
  Top 0.305: J4.1 J3.1 | v15.57,60.91 16.12,61.46 U4.6
  Bottom 0.305: J3.1 13.11,57.56 13.11,60.02 13.99,60.91 v15.57,60.91
N$18  (via drill 0.35)
  Top 0.305: J4.2 J3.2 | U4.4 16.08,62.89 15.27,62.89 14.51,62.13 v13.82,62.13
  Bottom 0.305: v13.82,62.13 12.29,60.6 12.29,57.76 10.1,55.56 J3.2
N$19  (via drill 0.35)
  Top 0.305: J3.3 J4.3 | U4.3 16.11,63.45 14.48,63.45 13.84,62.81 v12.68,62.81
  Bottom 0.305: v12.68,62.81 11.23,61.37 11.23,59.18 10.15,58.1 J3.3
N$20
  Top 0.305: J4.4 J3.4 8.57,63.5 10.16,65.09 14.61,65.09 15.26,64.43 U4.1
N$21
  Top 0.305: X1.15 62.26,59.84 61.65,60.45 61.65,62.25 U1.11
N$22
  Top 0.305: X1.14 61.84,58.84 60.35,60.32 60.35,62.28 U1.12
N$23
  Top 0.305: X1.13 61.54,57.84 59.08,60.3 59.08,62.28 U1.13
N$24
  Top 0.305: X1.6 66.71,50.84 65.05,52.5 65.05,55.68 63.6,57.12 61.27,57.12 57.81,60.58 57.81,62.28 U1.14
N$25
  Top 0.305: X1.5 66.9,49.84 64.47,52.27 64.47,55.42 63.48,56.41 60.53,56.41 56.54,60.4 56.54,62.28 U1.15
N$26
  Top 0.305: X1.4 67.85,48.82 66.55,48.82 63.91,51.46 63.91,55.02 63.12,55.8 60.17,55.8 55.24,60.73 U1.16
N$27  (via drill 0.35)
  Top 0.305: U1.17 53.98,56.9 v54,56.87 | v66.34,52.35 66.85,51.84 X1.7
  Bottom 0.305: v54,56.87 61.82,56.87 v66.34,52.35
N$28  (via drill 0.35)
  Top 0.305: X1.8 66.9,52.84 v66.17,53.57 | v52.73,58.06 52.7,58.09 U1.18
  Bottom 0.305: v66.17,53.57 61.67,58.06 v52.73,58.06
N$29
  Top 0.305: U$1.16 52.7,38.53 54,37.24 54,35.66 U2.8
N$30  (via drill 0.35)
  Top 0.305: X1.12 69.53,56.84 v69.55,56.82 | v65.05,31.09 62.87,28.91 U2.18
  Bottom 0.305: v69.55,56.82 69.55,35.58 v65.05,31.09
N$31  (via drill 0.35)
  Top 0.305: X1.11 v70.75,55.84 v70.76,55.85 | v67.13,31.9 63.8,31.9 61.62,29.72 61.62,26.62 U2.17
  Bottom 0.305: v70.76,55.85 70.76,35.53 v67.13,31.9
N$32  (via drill 0.35)
  Top 0.305: X1.10 71.93,54.84 v71.98,54.89 | v69.39,32.66 63.2,32.66 60.33,29.79 U2.16
  Bottom 0.305: v71.98,54.89 71.98,35.25 v69.39,32.66
N$33  (via drill 0.35)
  Top 0.305: v66.29,34.04 63.37,34.04 59.05,29.72 U2.15 | X1.9 67.11,53.84 66.34,54.61 v66.34,55.98
  Bottom 0.305: v66.29,34.04 68.68,36.42 68.68,53.64 v66.34,55.98
N$34
  Top 0.305: U$1.17 53.98,38.51 55.24,37.24 U2.7
N$35  (via drill 0.35)
  Top 0.305: J5.1 J2.1 9.87,34.61 10.74,35.48 10.74,38.81 v10.62,38.94 | v12.8,39.04 12.83,39.06 13.56,39.06 14.02,39.52 14.02,41.07 14.61,41.66 U5.4
  Bottom 0.305: v10.62,38.94 12.7,38.94 v12.8,39.04
N$36  (via drill 0.35)
  Top 0.305: J2.2 J5.2 | U5.6 15.8,40.19 v13.57,37.95
  Bottom 0.305: v13.57,37.95 12.77,37.15 J2.2
N$37
  Top 0.305: SV2.1 37.05,5.81 S1.1
N$38
  Top 0.305: U$3.4 40,26.9 39.34,27.56 37.87,27.56 36.27,25.96 34.9,25.96 C2.1
N$39  (via drill 0.35)
  Top 0.305: R1.1 24.44,19.58 28.68,15.34 38.23,15.34 v39.34,16.46 | v41.63,22.96 41.6,22.99 U$3.3
  Bottom 0.305: v39.34,16.46 41.63,18.75 v41.63,22.96
N$40  (via drill 0.35)
  Top 0.305: J2.3 J5.3 | U5.3 14.02,42.16 v13.41,41.55
  Bottom 0.305: v13.41,41.55 10.44,41.55 J2.3
N$41  (via drill 0.35)
  Top 0.305: J2.4 J5.4 | U5.1 15,43.97 v12.98,43.97
  Bottom 0.305: v12.98,43.97 11.24,42.23 J2.4
N$42
  Top 0.305: 0.01UF.1 21.55,41.16 U5.14
N$43  (via drill 0.35)  (1 unrouted)
  Top 0.305: U5.23 17.03,45.6 v17.5,46.08
N$44
  Top 0.305: U5.24 R2.1
N$45
  Top 0.305: R7.2 LED2.C
N$46  (via drill 0.35)
  Top 0.305: U5.5 15.2,41.16 v14.76,40.72 | v15.57,45.03 13.4,45.03 R3.1
  Bottom 0.305: v14.76,40.72 14.76,41.21 14.78,41.24 14.78,44.25 v15.57,45.03
N$47
  Top 0.305: U5.2 14.92,42.66 14.68,42.9 13.39,42.9 R4.1
N$48
  Top 0.305: U5.22 17.53,44.53 18.39,45.39 18.39,47.37 19.53,48.51 22.12,48.51 23.16,47.47 R9.1
N$49
  Top 0.305: U5.13 22.28,40.66 23.16,39.78 R8.1
N$50  (1 unrouted)
N$51  (1 unrouted)
N$52
  Top 0.305: LED5.C 4.32,23.29 4.78,22.84 4.78,21.34 5.59,20.52 6.4,20.52 9.25,23.37 10.77,23.37 R13.2
N$53  (2 unrouted)
N$54
  Top 0.305: U4.23 17.35,66.45 16,67.79 14.86,67.79 14.3,68.35 R17.1
N$55  (via drill 0.35)
  Top 0.305: R14.2 v12.7,24.92 | v6.04,24.87 6.04,23.3 LED6.C
  Bottom 0.305: v12.7,24.92 6.1,24.92 v6.04,24.87
N$56
  Top 0.305: U$2.D7 28.7,35.56 20.52,27.38 5.71,27.38 5.69,27.41 3.61,27.41 1.68,25.48 1.68,22.78 2.67,21.79 LED5.A
N$57
  Top 0.305: LED6.A 6.73,21.79 10.72,25.78 21.97,25.78 U$2.D8
N$65
  Top 0.305: R10.1 16.13,66.67 16.84,65.96 U4.24
N$66
  Top 0.305: 13.97,60.97 R15.1 15.46,62.43 U4.5
N$67
  Top 0.305: U4.2 16.11,63.95 R16.1
N$68
  Top 0.305: U4.14 23.24,62.43 0.01UF1.1
N$73
  Top 0.305: U4.22 17.85,68.22 R19.1
N$74  (via drill 0.35)
  Top 0.305: U4.13 20.93,61.93 v22.23,60.64 | R18.1 23.68,66.64 v23.65,66.67
  Bottom 0.305: v23.65,66.67 23.65,62.06 v22.23,60.64
N$75  (via drill 0.35)
  Top 0.305: U5.10 18.03,38.93 18.81,38.15 19.13,38.15 v19.48,37.79
  Bottom 0.305: J6.2 19.48,35.67 v19.48,37.79
N$76  (via drill 0.35)
  Top 0.305: v21.29,38.02 20.6,38.71 18.9,38.71 18.53,39.08 U5.11
  Bottom 0.305: v21.29,38.02 21.29,34.94 J6.1
N$77  (via drill 0.35)
  Top 0.305: U4.10 18.35,59.1 v18.62,58.83
  Bottom 0.305: v18.62,58.83 18.62,57.04 J8.2
N$78  (via drill 0.35)
  Top 0.305: U4.11 18.85,59.99 v19.38,59.46
  Bottom 0.305: v19.38,59.46 J8.1
N$79
  Top 0.305: R20.2 LED1.C
PULSE  (via drill 0.35)
  Top 0.305: U$1.1 62.87,47.45 v60.66,45.24 | LED2.A 68.22,43.33 v66.98,43.33
  Bottom 0.305: U$2.D2 39.75,48.26 41,47.01 41,41.58 43.23,39.34 48.34,39.34 54.23,45.24 v60.66,45.24 65.08,45.24 v66.98,43.33
SCK
  Bottom 0.305: U$2.D13 56.29,38.1 72.57,21.82 72.57,17.83 72.19,17.45 69.86,17.45 M1.5
SCL
  Top 0.305: U6.6 47.37,18.09 45.9,18.09 43.48,20.5 43.48,27 42.24,28.25 37.8,28.25 U$2.A5
SDA  (via drill 0.35)
  Top 0.305: U6.5 47.38,25.57 v44.98,27.96
  Bottom 0.305: v44.98,27.96 35.53,27.96 U$2.A4
STEP1  (via drill 0.35)
  Top 0.305: U4.8 17.35,59.61 v16.36,58.62 | v15.54,51.21 17.14,49.61 v20.83,49.61 | v23.93,50.65 23.93,48.82 27,45.74 29.18,45.74 U$2.D3
  Bottom 0.305: v16.36,58.62 16.36,57.07 14.86,55.57 14.86,51.89 v15.54,51.21 | v20.83,49.61 21.87,50.65 v23.93,50.65
STEP2  (via drill 0.35)
  Top 0.305: 22.84,37.64 v22.91,37.57 22,37.57 20.88,36.45 17.65,36.45 17.02,37.08 17.02,39.92 U5.8 | v24.28,35.05 24.28,35.71 U$2.D5
  Bottom 0.305: v22.91,37.57 22.91,36.42 v24.28,35.05
VCC  (via drill 0.35)
  Top 0.305: S1.2 34.39,7.41 C5.1 30.06,7.3 U3.1 | v34.39,68.66 41.45,68.66 C21.1 C22.1 C23.1 C24.1
  Bottom 0.305: v34.39,68.66 25.65,59.92 25.65,18.61 34.42,9.84 S1.2
VINT1  (via drill 0.35)
  Top 0.305: 4.7UF1.2 14.48,57.25 15.62,57.25 16.1,57.73 19.89,57.73 20.37,58.22 20.37,59.44 19.35,60.46 U4.12 19.37,61.19 v20.12,61.19 | U4.17 21.16,63.93 v21.39,63.7
  Bottom 0.305: v21.39,63.7 21.39,62.46 v20.12,61.19
VINT2  (via drill 0.35)
  Top 0.305: 4.7UF.2 15.16,38.43 v15.21,38.48 | U5.17 20.43,42.66 21.41,43.64 v21.41,44.91 | U5.12 21.23,39.93 v21.31,39.85
  Bottom 0.305: 21.29,45.03 v21.41,44.91 21.31,44.81 | 21.31,44.81 v21.31,39.85 | v15.21,38.48 15.21,38.71 21.31,44.81

### Text on the board
bPlace: Beeclust - Multi Robot Systems Lab | Main Board v1.0 | Open Source | Hardware | #KarpeDiem